# Altium schematic sheet PortSplitters.SchDoc
size A; Organization: Altium Limited; Address1: L3, 12a Rodborough Rd; Address2: Frenchs Forest; Address3: NSW; Address4: Australia 2086; DocumentNumber: 4; SheetNumber: 2; SheetTotal: 5
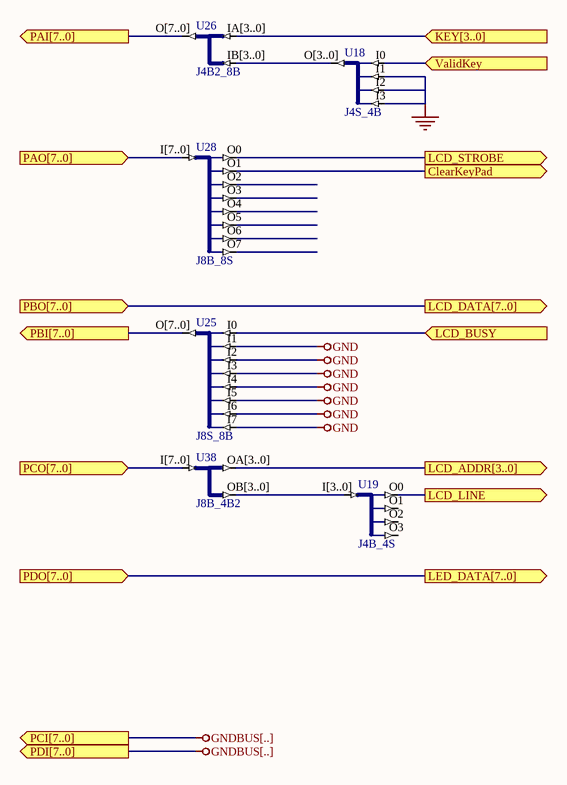
[diagram p0: PortSplitters.SchDoc]

## Parts
U18  J4S_4B
U19  J4B_4S
U25  J8S_8B
U26  J4B2_8B
U28  J8B_8S
U38  J8B_4B2

## Ports
ClearKeyPad (out), KEY[3..0] (in), LCD_ADDR[3..0] (out), LCD_BUSY (in), LCD_DATA[7..0] (out), LCD_LINE (out), LCD_STROBE (out), LED_DATA[7..0] (out), PAI[7..0] (out), PAO[7..0] (in), PBI[7..0] (out), PBO[7..0] (in), PCI[7..0] (out), PCO[7..0] (in), PDI[7..0] (out), PDO[7..0] (in), ValidKey (in)

## Nets
GND: U18.I1 U18.I2 U18.I3 U25.I1 U25.I2 U25.I3 U25.I4 U25.I5 U25.I6 U25.I7
ClearKeyPad: U28.O1 ; port ClearKeyPad
KEY[3..0]: U26.IA[3..0] ; port KEY[3..0]
LCD_ADDR[3..0]: U38.OA[3..0] ; port LCD_ADDR[3..0]
LCD_BUSY: U25.I0 ; port LCD_BUSY
LCD_LINE: U19.O0 ; port LCD_LINE
LCD_STROBE: U28.O0 ; port LCD_STROBE
PAI[7..0]: U26.O[7..0] ; port PAI[7..0]
PAO[7..0]: U28.I[7..0] ; port PAO[7..0]
PBI[7..0]: U25.O[7..0] ; port PBI[7..0]
PCO[7..0]: U38.I[7..0] ; port PCO[7..0]
ValidKey: U18.I0 ; port ValidKey
NetU18_O[3..0]: U18.O[3..0] U26.IB[3..0]
NetU19_I[3..0]: U19.I[3..0] U38.OB[3..0]

Not connected (* = marked no-connect by the designer): U19 O1 O2 O3; U28 O2 O3 O4 O5 O6 O7

## Buses and harness runs
bus port LCD_DATA[7..0] = port PBO[7..0]
bus port LED_DATA[7..0] = port PDO[7..0]

## Notes on the sheet
- Title
- Size:
- Date:
- A
- Number:
- Time:
- Revision:
- Sheet
- of
- File:

## Library data of the parts
U18 = J4S_4B: 4 Single pin inputs to single 4-Bit output bus; ArchiveName: GENERIC; Published: 18-Dec-2003; Publisher: Altium Limited; Core Revision: 1.00.00
U19 = J4B_4S: 4-Bit input bus to 4 Single pin outputs; ArchiveName: GENERIC; Published: 18-Dec-2003; Publisher: Altium Limited; Core Revision: 1.00.00
U25 = J8S_8B: 8 Single pin inputs to single 8-Bit output bus; ArchiveName: GENERIC; Published: 18-Nov-2003; Publisher: Altium Limited; Core Revision: 1.00.00
U26 = J4B2_8B: 2 x 4-Bit input bus to 1 x 8-bit output bus; ArchiveName: GENERIC; Published: 18-Nov-2003; Publisher: Altium Limited; Core Revision: 1.00.00
U28 = J8B_8S: 8-Bit input bus to 8 single pin outputs; ArchiveName: GENERIC; Published: 18-Nov-2003; Publisher: Altium Limited; Core Revision: 1.00.00
U38 = J8B_4B2: 1 x 8-bit input bus to 2 x 4-Bit output bus; ArchiveName: GENERIC; Published: 18-Dec-2003; Publisher: Altium Limited; Core Revision: 1.00.00